# Altium schematic sheet sensor_specific.SchDoc
size A4
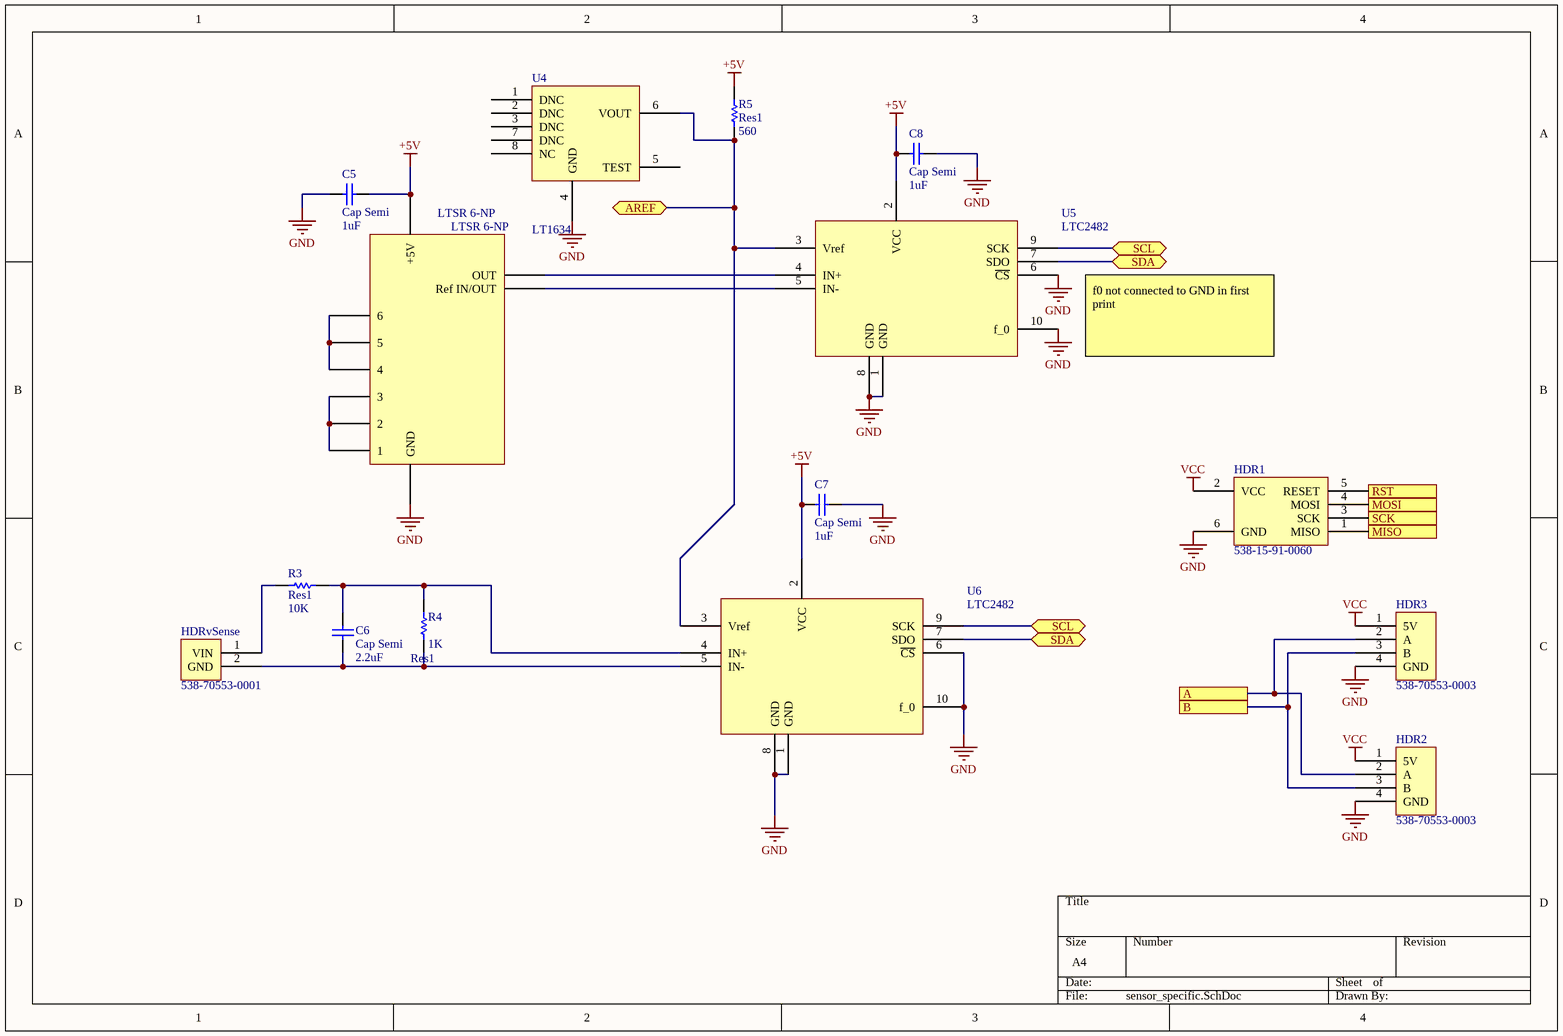
[diagram p0: sensor_specific.SchDoc]

## Parts
C5  Cap Semi  value 1uF  [1608[0603]]
C6  Cap Semi  value 2.2uF  [1608[0603]]
C7  Cap Semi  value 1uF  [1608[0603]]
C8  Cap Semi  value 1uF  [1608[0603]]
HDR1  Supplier Part Number 1: 538-15-91-0060  [MOLEX_HEADER_6_SMD]  (hidden comment: Programming header)
HDR2  Supplier Part Number 1: 538-70553-0003  [MOLEX_HEADER_4H_SHRD]  (hidden comment: RS-485 interface)
HDR3  Supplier Part Number 1: 538-70553-0003  [MOLEX_HEADER_4H_SHRD]  (hidden comment: RS-485 interface)
HDRvSense  Supplier Part Number 1: 538-70553-0001  [MOLEX_HEADER_2H_SHRD]  (hidden comment: MOLEX_HEADER_2H_SHRD)
LTSR_6-NP  LTSR 6-NP  [LTSR 6-NP]
R3  Res1  value 10K  [6-0805_N]
R4  Res1  value 1K  [6-0805_N]
R5  Res1  value 560  [6-0805_N]
U4  LT1634  [8S1_N]
U5  LTC2482  [DFN33]
U6  LTC2482  [DFN33]

## Ports
A, AREF, B, MISO, MOSI, RST, SCK, SCL, SDA

## Nets
+5V: C5.2 C7.1 C8.1 LTSR_6-NP.+5V R5.2 U5.2(VCC) U6.2(VCC)
GND: C5.1 C7.2 C8.2 HDR1.6(GND) HDR2.4(GND) HDR3.4(GND) LTSR_6-NP.GND U4.4(GND) U5.1(GND) U5.6(~{CS}) U5.8(GND) U5.10(f_0) U6.1(GND) U6.6(~{CS}) U6.8(GND) U6.10(f_0)
VCC: HDR1.2(VCC) HDR2.1(5V) HDR3.1(5V)
A: HDR2.2(A) HDR3.2(A) ; port A
AREF: R5.1 U4.6(VOUT) U5.3(Vref) U6.3(Vref) ; port AREF
B: HDR2.3(B) HDR3.3(B) ; port B
MISO: HDR1.1(MISO) ; port MISO
MOSI: HDR1.4(MOSI) ; port MOSI
RST: HDR1.5(RESET) ; port RST
SCK: HDR1.3(SCK) ; port SCK
SCL: U5.9(SCK) U6.9(SCK) ; port SCL
SDA: U5.7(SDO) U6.7(SDO) ; port SDA
NetC6_1: C6.1 HDRvSense.2(GND) R4.2 U6.5(IN-)
NetC6_2: C6.2 R3.1 R4.1 U6.4(IN+)
NetHDRvSense_1: HDRvSense.1(VIN) R3.2
NetLTSR_6-NP_1: LTSR_6-NP.1 LTSR_6-NP.2 LTSR_6-NP.3
NetLTSR_6-NP_4: LTSR_6-NP.4 LTSR_6-NP.5 LTSR_6-NP.6
NetLTSR_6-NP_OUT: LTSR_6-NP.OUT U5.4(IN+)
NetLTSR_6-NP_ref: LTSR_6-NP.ref(Ref_IN/OUT) U5.5(IN-)

Not connected (* = marked no-connect by the designer): U4 1(DNC) 2(DNC) 3(DNC) 5(TEST) 7(DNC) 8(NC)

## Notes on the sheet
- f0 not connected to GND in first print

## Library data of the parts
C5-C8 = Cap Semi: Capacitor (Semiconductor SIM Model); Published: 8-Jun-2000; LatestRevisionDate: 29-May-2009; LatestRevisionNote: IPC-7351 Footprint Added.; PackageReference: C1206; Publisher: Altium Limited; PackageDescription: Chip Capacitor
HDR1 = PRGM_HDR: Supplier 1: Mouser
HDR2 HDR3 = MABSS_RS485: Part Number: 70553-0003. MABSS connector; Supplier 1: Mouser
HDRvSense = MOLEX_HEADER_2H_SHRD: Part Number: 70553-0001. 2-wire signal inputs; Supplier 1: Mouser
R3-R5 = Res1: Resistor; Published: 8-Jun-2000; LatestRevisionDate: 17-Jul-2002; LatestRevisionNote: Re-released for DXP Platform.; PackageReference: AXIAL-0.3; Publisher: Altium Limited; PackageDescription: Axial Device, Thru-Hole; 2 Leads; 0.3 in Pin Spacing